# EAGLE design Cheat_Code (EAGLE 9.6.2)
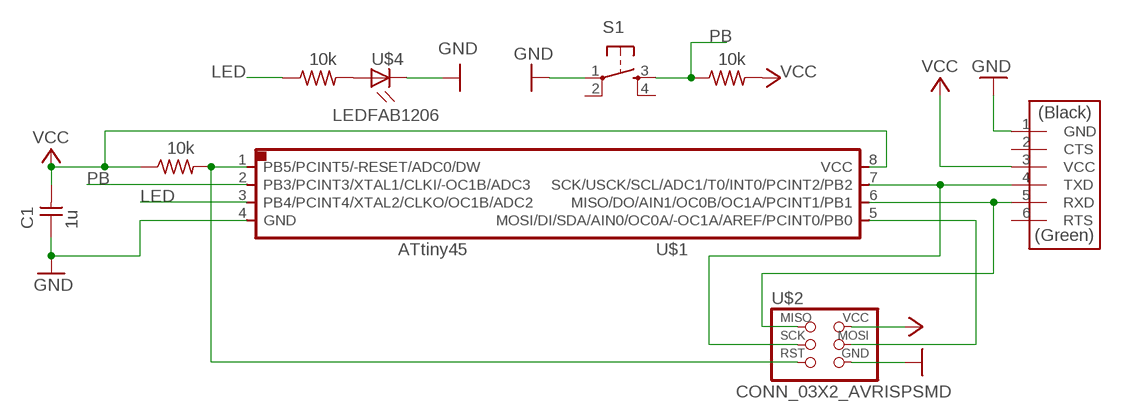
[diagram p0: schematic, sheet 1]

## Parts
C1  1u  CAP_UNPOLARIZEDFAB  [C1206FAB]
R1  10k  R1206  [R1206]
R2  10k  R1206  [R1206]
R3  10k  R1206  [R1206]
S1  SW_SWITCH_TACTILE_6MM6MM_SWITCH  [6MM_SWITCH]
U$1  UC_ATTINY45SI  [SOIC8]
U$2  CONN_03X2_AVRISPSMD  [2X03SMD]
U$3  CONN_06_FTDI-SMD-HEADER  [1X06SMD]
U$4  LEDFAB1206  [LED1206FAB]

## Nets
GND: C1.1 S1.1(P) U$1.4(GND) U$2.6(GND) U$3.1(GND) U$4.2(C)
LED: R3.1 U$1.3(PB4/PCINT4/XTAL2/CLKO/OC1B/ADC2)
N$1: U$1.6(MISO/DO/AIN1/OC0B/OC1A/PCINT1/PB1) U$2.1(MISO) U$3.5(RXD)
N$2: U$1.7(SCK/USCK/SCL/ADC1/T0/INT0/PCINT2/PB2) U$2.3(SCK) U$3.4(TXD)
N$3: R2.2 U$1.1(PB5/PCINT5/-RESET/ADC0/DW) U$2.5(RST)
N$4: U$1.5(MOSI/DI/SDA/AIN0/OC0A/-OC1A/AREF/PCINT0/PB0) U$2.4(MOSI)
N$5: R3.2 U$4.1(A)
PB: R1.1 S1.3(S) U$1.2(PB3/PCINT3/XTAL1/CLKI/-OC1B/ADC3)
VCC: C1.2 R1.2 R2.1 U$1.8(VCC) U$2.2(VCC) U$3.3(VCC)
Unconnected: S1.2(P1) S1.4(S1) U$3.2(CTS) U$3.6(RTS)

## Library data of the parts
C1 = fab:CAP_UNPOLARIZED
R1-R3 = fab:R: Resistor (US Symbol) Variants with postfix FAB are widened to allow the routing of internal traces
S1 = fab:SW_SWITCH_TACTILE_6MM: OMRON SWITCH
U$1 = fab:UC_ATTINY45
U$2 = fab:CONN_03X2_AVRISP
U$3 = fab:CONN_06_FTDI-SMD-HEADER
U$4 = fab:LED: LED

## Board
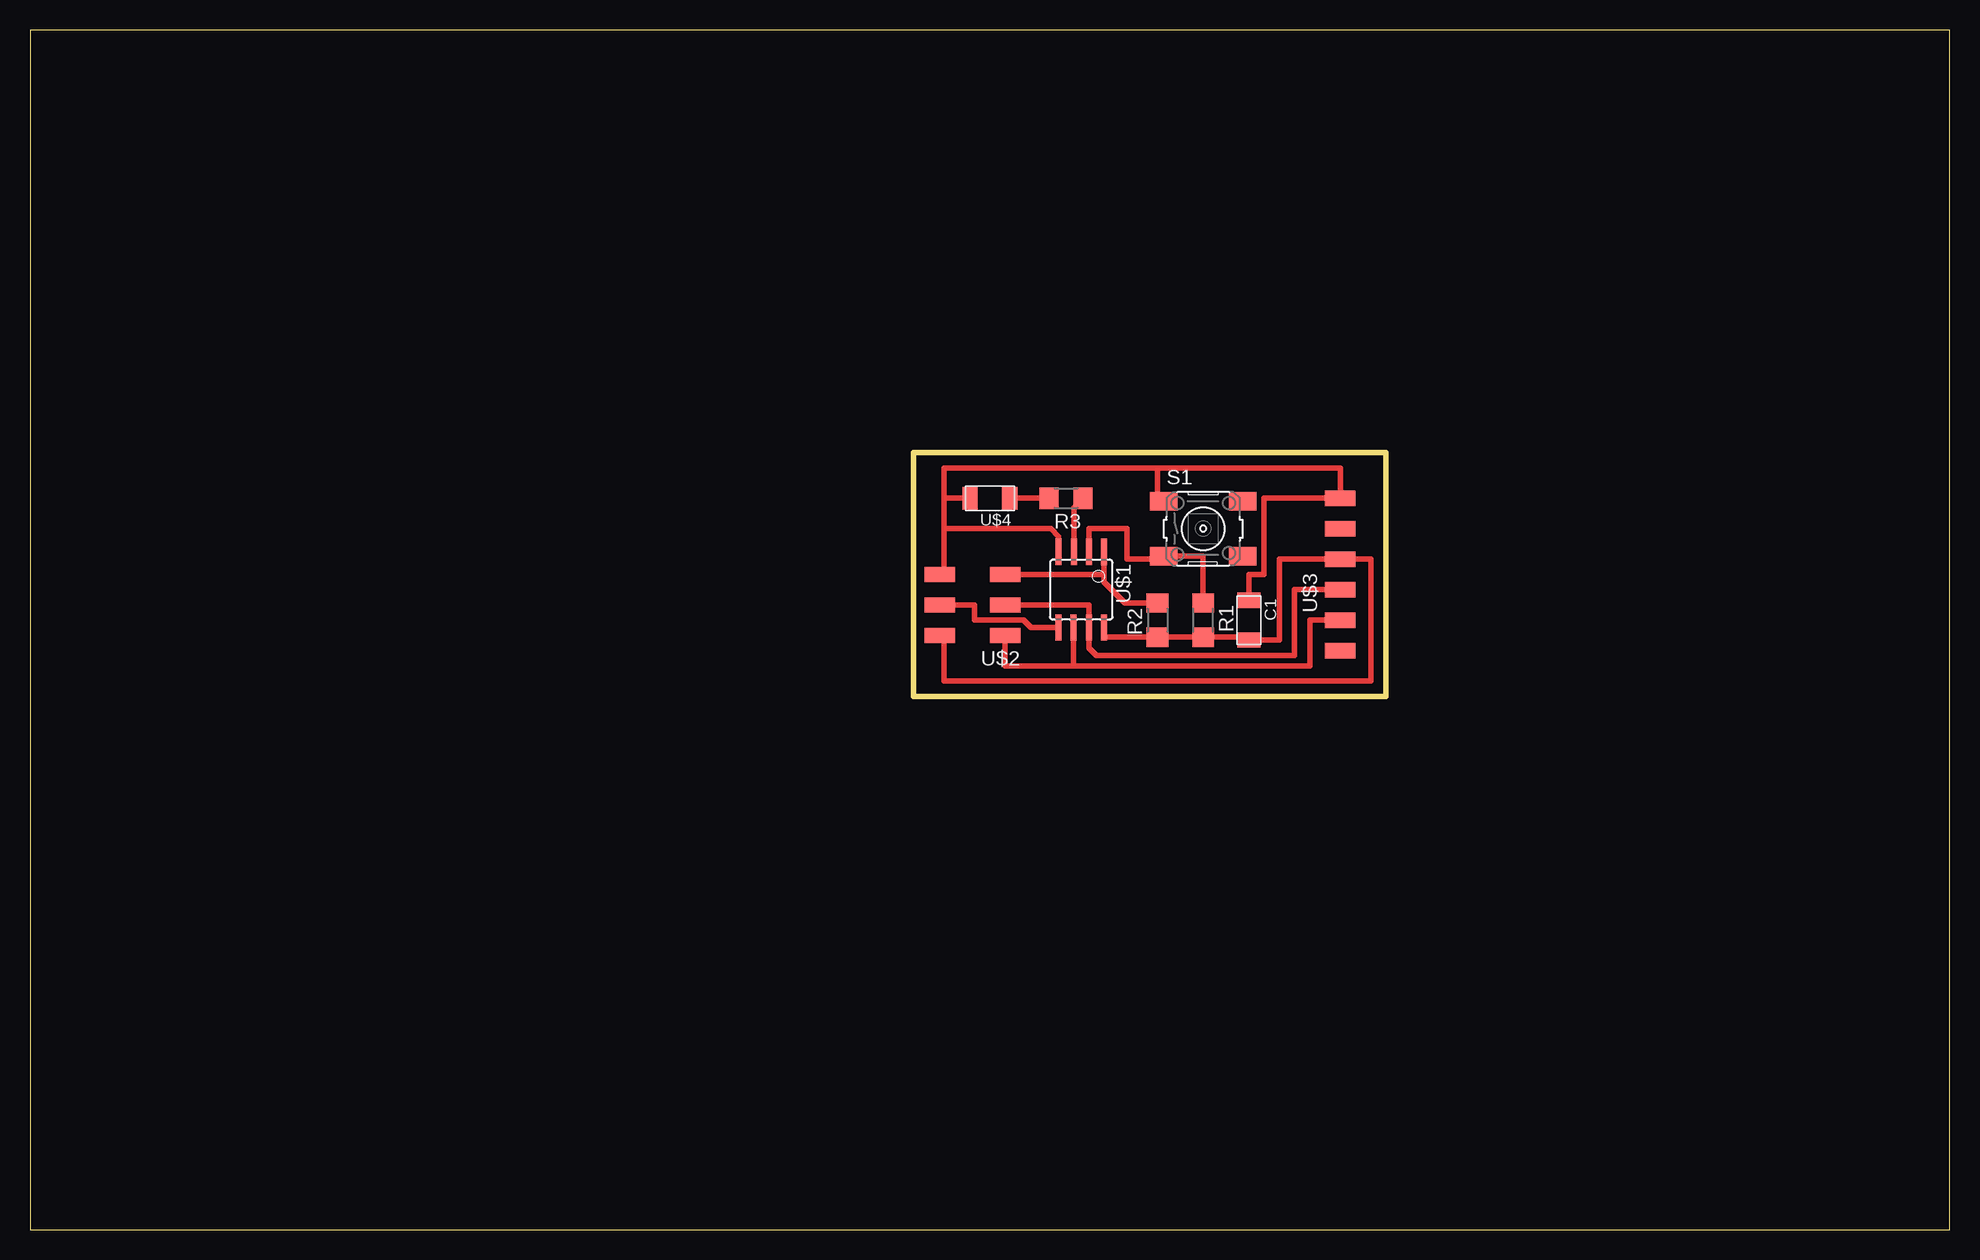
[diagram p1: board, top side]

Size 160 x 100 mm. Coordinates in mm from the lower left corner, seen from the top.
Outline: 0,0 160,0 160,100 0,100 0,0
Copper layers (1*16): Top 0.035mm / dielectric 1.5mm / Bottom 0.035mm
Design rules "default *": minimum track width 18mil, minimum drill 0.35mm, track to track 16mil, track to pad 16mil, pad to pad 16mil, via to via 12mil, smd to smd 10mil, copper to edge 40mil, drill to drill 6mil, minimum pad ring 10mil, minimum via ring 8mil, stop-mask expansion 4mil, vias tented up to drill 0mil, thermal gap 10mil
Milling: 6 lines

### Footprints (pad centres in the part's own frame; a part is rotated, then mirrored left to right if it is on the bottom)
C1206FAB = smd 1.27 x 1.905: 1 -1.651,0; 2 1.651,0
R1206 = smd 1.6 x 1.803: 1 -1.422,0; 2 1.422,0
6MM_SWITCH = smd 2.286 x 1.524: 1 -3.302,2.286; 2 3.302,2.286; 3 -3.302,-2.286; 4 3.302,-2.286
SOIC8 = smd 0.5 x 2.2: 1 -1.905,-3.154; 2 -0.645,-3.154; 3 0.625,-3.154; 4 1.895,-3.154; 5 1.905,3.154; 6 0.635,3.154; 7 -0.635,3.154; 8 -1.905,3.154
2X03SMD = smd 2.54 x 1.27: 1 -2.54,2.54; 2 2.92,2.54; 3 -2.54,0; 4 2.92,0; 5 -2.54,-2.54; 6 2.92,-2.54
1X06SMD = smd 2.54 x 1.27: 1 0,6.35; 2 0,3.81; 3 0,1.27; 4 0,-1.27; 5 0,-3.81; 6 0,-6.35
LED1206FAB = smd 1.27 x 1.905: 1 -1.651,0; 2 1.651,0

### Placement (x,y rotation side)
C1  101.6,50.8 270 top
R1  97.79,50.8 270 top
R2  93.98,50.8 90 top
R3  86.36,60.96 180 top
S1  97.79,58.42 0 top
U$1  87.63,53.34 180 top
U$2  78.74,52.07 180 top
U$3  109.22,54.61 0 top
U$4  80.01,60.96 180 top

### Tracks (layer width: path | path; a pad name or v marks a point on that pad's centre or on a via)
GND
  Top 0.457: 93.98,63.5 76.2,63.5 76.2,60.96 | 93.98,63.5 109.22,63.5 U$3.1 102.87,60.96 102.87,54.61 101.6,54.61 C1.1 | U$4.2 76.2,60.96 | S1.1 93.98,61.21 93.98,63.5 | U$1.4 85.73,57.77 85.09,58.42 76.2,58.42 | U$2.6 76.2,54.99 76.2,58.42 | 76.2,58.42 76.2,60.96
LED
  Top 0.457: R3.1 87,60.18 U$1.3
N$1
  Top 0.457: U$3.5 106.68,50.8 106.68,46.99 87,46.99 | 87,46.99 81.28,46.99 U$2.1 | U$1.6 87,46.99
N$2
  Top 0.457: U$3.4 105.41,53.34 105.41,47.85 88.9,47.85 88.27,48.49 U$1.7 88.27,52.07 U$2.3
N$3
  Top 0.457: U$1.1 89.53,54.61 | 89.53,54.61 89.53,53.98 91.29,52.22 R2.2 | U$2.5 89.53,54.61
N$4
  Top 0.457: U$2.4 78.74,52.07 78.74,50.8 82.81,50.8 83.43,50.19 U$1.5
N$5
  Top 0.457: U$4.1 R3.2
PB
  Top 0.457: U$1.2 88.28,58.42 91.44,58.42 91.44,55.88 94.23,55.88 S1.3 97.79,56.13 R1.1
VCC
  Top 0.457: U$2.2 76.2,49.15 76.2,45.72 111.76,45.72 111.76,55.88 U$3.3 104.14,55.88 104.14,49.15 C1.2 101.37,49.38 R1.2 R2.1 89.69,49.38 89.53,49.53 U$1.8